# Altium schematic sheet 02_LEDs.SchDoc: Serial LEDs
size A; Revision: A; SheetNumber: 2; SheetTotal: 6
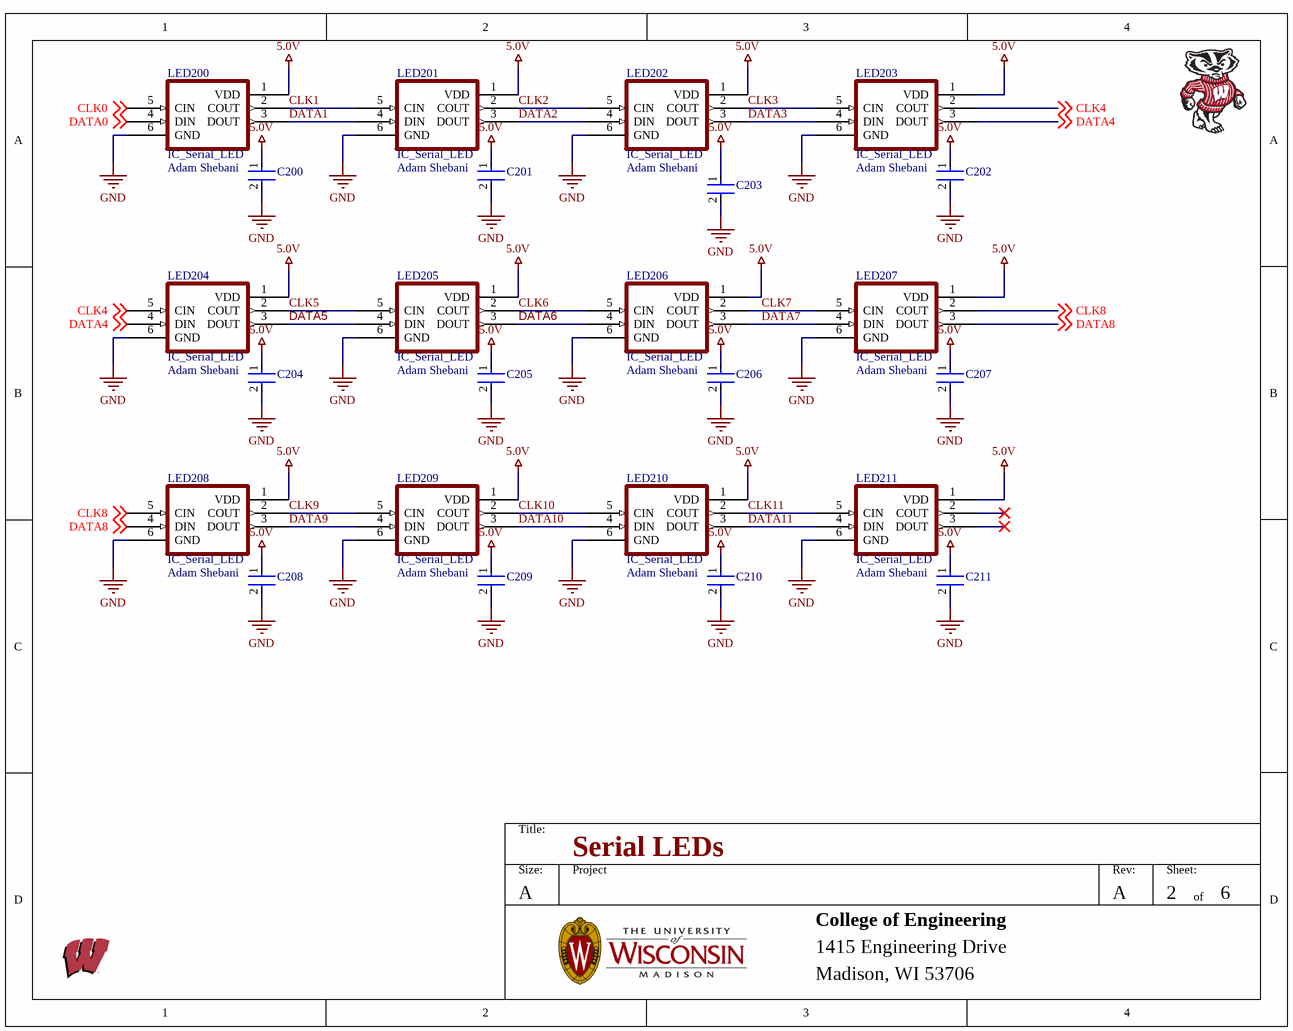
[diagram p0: 02_LEDs.SchDoc]

## Parts
C200  CC1206KRX7R8BB104  [FP-CC1206-1_25-MFG]  (value not drawn)
C201  CC1206KRX7R8BB104  [FP-CC1206-1_25-MFG]  (value not drawn)
C202  CC1206KRX7R8BB104  [FP-CC1206-1_25-MFG]  (value not drawn)
C203  CC1206KRX7R8BB104  [FP-CC1206-1_25-MFG]  (value not drawn)
C204  CC1206KRX7R8BB104  [FP-CC1206-1_25-MFG]  (value not drawn)
C205  CC1206KRX7R8BB104  [FP-CC1206-1_25-MFG]  (value not drawn)
C206  CC1206KRX7R8BB104  [FP-CC1206-1_25-MFG]  (value not drawn)
C207  CC1206KRX7R8BB104  [FP-CC1206-1_25-MFG]  (value not drawn)
C208  CC1206KRX7R8BB104  [FP-CC1206-1_25-MFG]  (value not drawn)
C209  CC1206KRX7R8BB104  [FP-CC1206-1_25-MFG]  (value not drawn)
C210  CC1206KRX7R8BB104  [FP-CC1206-1_25-MFG]  (value not drawn)
C211  CC1206KRX7R8BB104  [FP-CC1206-1_25-MFG]  (value not drawn)
LED200  IC_Serial_LED  Drawn By: Adam Shebani  [IC_Serial_LED]
LED201  IC_Serial_LED  Drawn By: Adam Shebani  [IC_Serial_LED]
LED202  IC_Serial_LED  Drawn By: Adam Shebani  [IC_Serial_LED]
LED203  IC_Serial_LED  Drawn By: Adam Shebani  [IC_Serial_LED]
LED204  IC_Serial_LED  Drawn By: Adam Shebani  [IC_Serial_LED]
LED205  IC_Serial_LED  Drawn By: Adam Shebani  [IC_Serial_LED]
LED206  IC_Serial_LED  Drawn By: Adam Shebani  [IC_Serial_LED]
LED207  IC_Serial_LED  Drawn By: Adam Shebani  [IC_Serial_LED]
LED208  IC_Serial_LED  Drawn By: Adam Shebani  [IC_Serial_LED]
LED209  IC_Serial_LED  Drawn By: Adam Shebani  [IC_Serial_LED]
LED210  IC_Serial_LED  Drawn By: Adam Shebani  [IC_Serial_LED]
LED211  IC_Serial_LED  Drawn By: Adam Shebani  [IC_Serial_LED]

## Nets
5.0V: C200.1 C201.1 C202.1 C203.1 C204.1 C205.1 C206.1 C207.1 C208.1 C209.1 C210.1 C211.1 LED200.1(VDD) LED201.1(VDD) LED202.1(VDD) LED203.1(VDD) LED204.1(VDD) LED205.1(VDD) LED206.1(VDD) LED207.1(VDD) LED208.1(VDD) LED209.1(VDD) LED210.1(VDD) LED211.1(VDD)
GND: C200.2 C201.2 C202.2 C203.2 C204.2 C205.2 C206.2 C207.2 C208.2 C209.2 C210.2 C211.2 LED200.6(GND) LED201.6(GND) LED202.6(GND) LED203.6(GND) LED204.6(GND) LED205.6(GND) LED206.6(GND) LED207.6(GND) LED208.6(GND) LED209.6(GND) LED210.6(GND) LED211.6(GND)
CLK0: LED200.5(CIN) ; off-sheet CLK0
CLK1: LED200.2(COUT) LED201.5(CIN)
CLK2: LED201.2(COUT) LED202.5(CIN)
CLK3: LED202.2(COUT) LED203.5(CIN)
CLK4: LED203.2(COUT) LED204.5(CIN) ; off-sheet CLK4
CLK5: LED204.2(COUT) LED205.5(CIN)
CLK6: LED205.2(COUT) LED206.5(CIN)
CLK7: LED206.2(COUT) LED207.5(CIN)
CLK8: LED207.2(COUT) LED208.5(CIN) ; off-sheet CLK8
CLK9: LED208.2(COUT) LED209.5(CIN)
CLK10: LED209.2(COUT) LED210.5(CIN)
CLK11: LED210.2(COUT) LED211.5(CIN)
DATA0: LED200.4(DIN) ; off-sheet DATA0
DATA1: LED200.3(DOUT) LED201.4(DIN)
DATA2: LED201.3(DOUT) LED202.4(DIN)
DATA3: LED202.3(DOUT) LED203.4(DIN)
DATA4: LED203.3(DOUT) LED204.4(DIN) ; off-sheet DATA4
DATA5: LED204.3(DOUT) LED205.4(DIN)
DATA6: LED205.3(DOUT) LED206.4(DIN)
DATA7: LED206.3(DOUT) LED207.4(DIN)
DATA8: LED207.3(DOUT) LED208.4(DIN) ; off-sheet DATA8
DATA9: LED208.3(DOUT) LED209.4(DIN)
DATA10: LED209.3(DOUT) LED210.4(DIN)
DATA11: LED210.3(DOUT) LED211.4(DIN)

Not connected (* = marked no-connect by the designer): LED211 2(COUT)* 3(DOUT)*

## Notes on the sheet
- Title:
- Size:
- A
- Project
- Rev:
- Sheet:
- of
- College of Engineering
- 1415 Engineering Drive
- Madison, WI 53706

## Library data of the parts
C200-C211 = CMP-1037-04191-3: CAP CER 0.1UF 25V X7R 1206; Manufacturer: Yageo; Value: 100 nF; Material: Ceramic; Tolerance: 0.1; Automotive Grade: NA; Temperature Coefficient: 15%; Description: CC1206 100 nF X7R 10.00%25 V; Category: Cap; Voltage Rating: 25 V; Temperature Range Low: -55°C; Lead Free: Yes; Mouser Description: Multilayer Ceramic Capacitors MLCC - SMD/SMT 100nF 25V X7R 10%; Manufacturer Part Number: CC1206KRX7R8BB104; Octopart: https://octopart.com/cc1206krx7r8bb104-yageo-42334534; Device Class L1: Passive Components; Capacitance: 100 nF; RoHS: TRUE; Automotive: No; Package: CC1206-1.25; Device Class L2: Capacitors; Footprint Url: http://www.yageo.com/exep/pages/download/literatures/UPY-C_GEN_24.pdf; Height: 1.45mm; Temperature: -55°C to +125°C; Temperature Range High: +125°C; ComponentLink2URL: http://www.yageo.com/documents/recent/UPY-NP0X7R_HV_1KV-to-3KV_11.pdf; Temperature Characteristic: X7R; Device Class L3: Ceramic Capacitors; Digikey Description: CAP CER 0.1UF 25V X7R 1206; ComponentLink2Description: Datasheet
LED200-LED211 = IC_Serial_LED: Manufacturer: Harvatek; Manufacturer Part Number: T3A33BRG-H9C0002X1U1930; Supplier: DigiKey; Supplier Part Number: 3147-T3A33BRG-H9C0002X1U1930CT-ND; Category: Optoelectronics; Stock: 6384; Pricing: 1=0.25, 1000=0.23807 (USD)